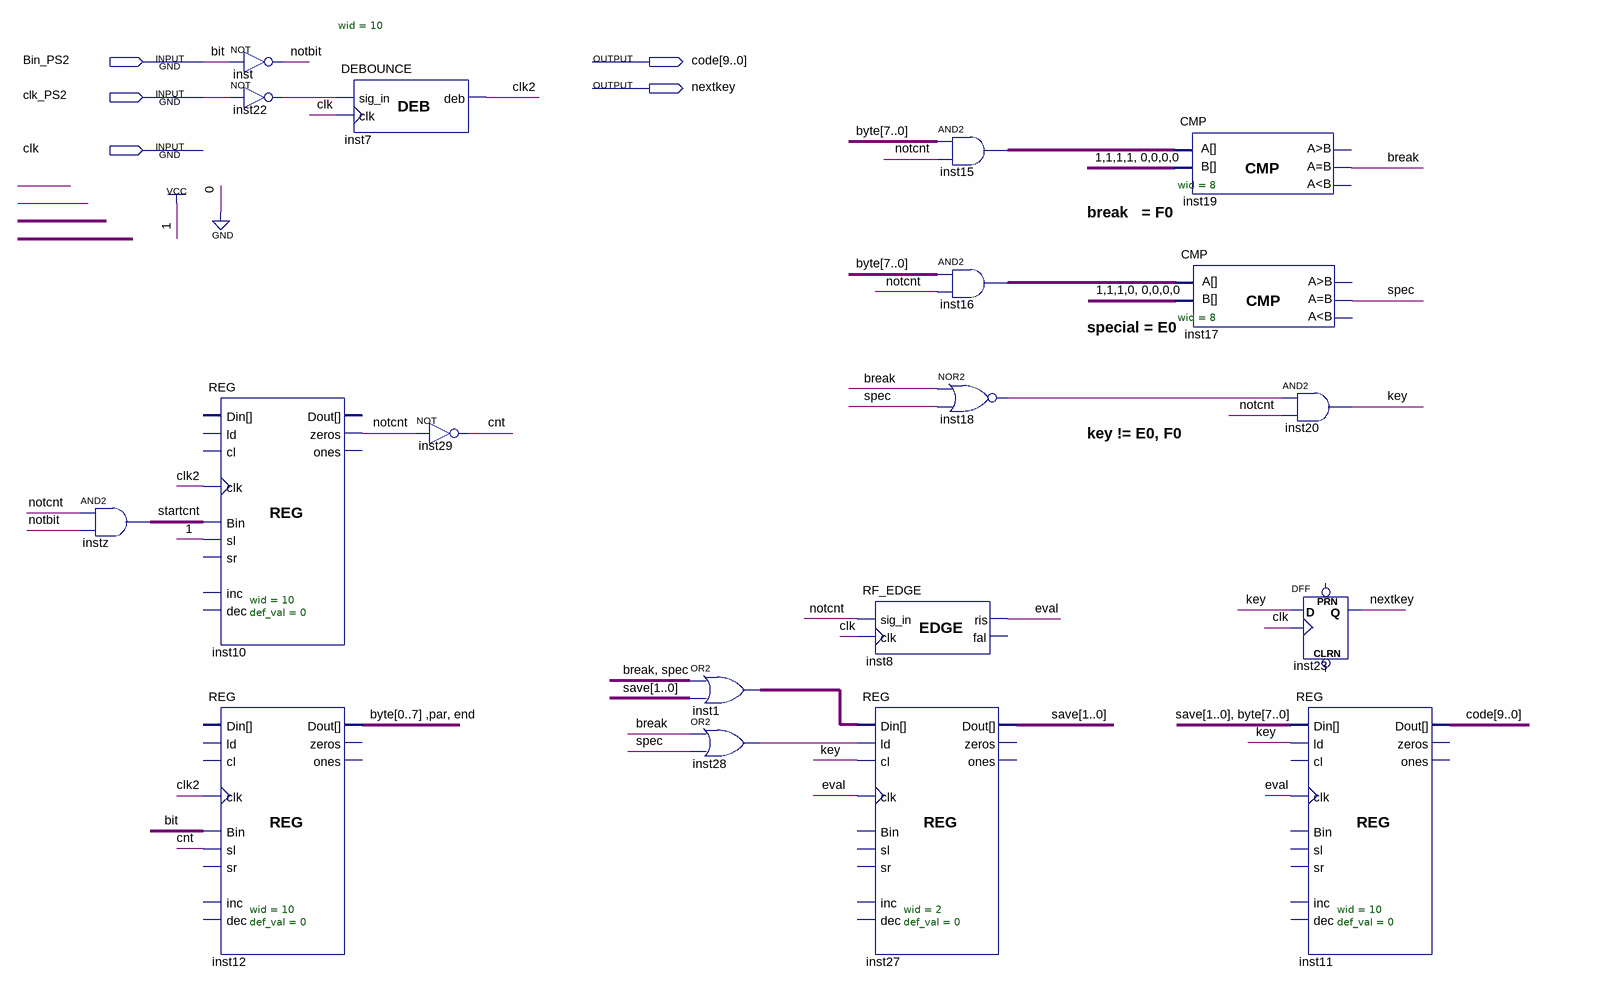
[diagram p0: schematic sheet]
// Quartus schematic KEYBOARD.bdf as structural Verilog: 19 symbols, 5 pins
module KEYBOARD (
  input  Bin_PS2,
  input  clk_PS2,
  input  clk,
  output [9:0] code,
  output nextkey
);

  wire \break , clk2, cnt, \end , eval, inst18_out, inst22_out, inst28_out, key, notbit, notcnt, par, spec,
       startcnt;
  wire [1:0] inst1_out, save;
  wire [7:0] \byte , inst15_out, inst16_out;

  and instz (startcnt, notcnt, notbit);
  REG #(.wid(10), .def_val(0)) inst10 (
    .clk(clk2), .Bin(startcnt), .sl(1'b1), .zeros(notcnt));  // open: ld, cl, sr, inc, dec, Din, Dout, ones
  REG #(.wid(10), .def_val(0)) inst12 (
    .clk(clk2), .Bin(Bin_PS2), .sl(cnt),
    .Dout({\byte [0], \byte [1], \byte [2], \byte [3], \byte [4], \byte [5], \byte [6], \byte [7], par, \end }));  // open: ld, cl, sr, inc, dec, Din, zeros, ones
  not inst (notbit, Bin_PS2);
  not inst22 (inst22_out, clk_PS2);
  DEBOUNCE #(.wid(10)) inst7 (.sig_in(inst22_out), .clk(clk), .deb(clk2));
  not inst29 (cnt, notcnt);
  assign inst1_out = {\break , spec} | save;  // OR2 inst1, 2 bits wide
  or inst28 (inst28_out, \break , spec);
  RF_EDGE inst8 (.sig_in(notcnt), .clk(clk), .ris(eval));  // open: fal
  REG #(.wid(2), .def_val(0)) inst27 (
    .ld(inst28_out), .cl(key), .clk(eval), .Din(inst1_out), .Dout(save));  // open: Bin, sl, sr, inc, dec, zeros, ones
  assign inst15_out = \byte  & {8{notcnt}};  // AND2 inst15, 8 bits wide
  assign inst16_out = \byte  & {8{notcnt}};  // AND2 inst16, 8 bits wide
  nor inst18 (inst18_out, \break , spec);
  CMP #(.wid(8)) inst19 (.A(inst15_out), .B(8'b11110000), .eq(\break ));  // open: gr, ls
  CMP #(.wid(8)) inst17 (.A(inst16_out), .B(8'b11100000), .eq(spec));  // open: gr, ls
  and inst20 (key, inst18_out, notcnt);
  DFF inst23 (.CLK(clk), .D(key), .Q(nextkey));  // open: CLRN, PRN
  REG #(.wid(10), .def_val(0)) inst11 (
    .ld(key), .clk(eval), .Din({save, \byte }), .Dout(code));  // open: cl, Bin, sl, sr, inc, dec, zeros, ones

  // Other names for the same wires on the sheet: bit = Bin_PS2

  // Notes on the sheet:
  //   break   = F0
  //   special = E0
  //   key != E0, F0
endmodule
